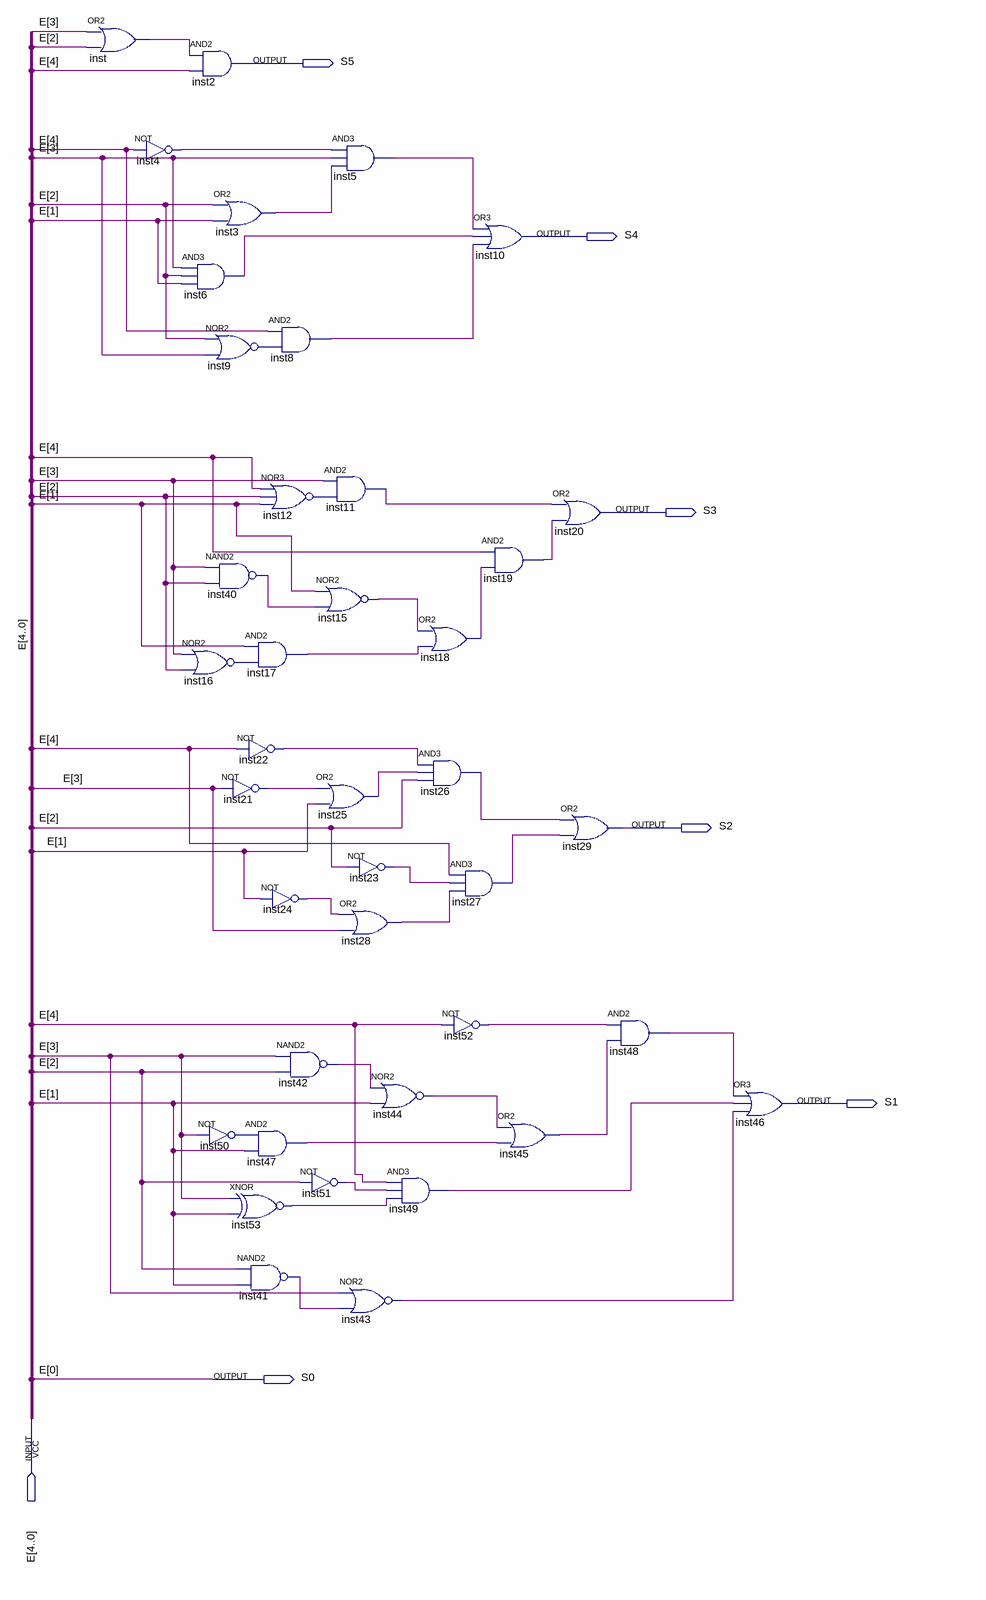
[diagram p0: schematic sheet]
// Quartus schematic SixBitsToBcdPositive.bdf as structural Verilog: 40 symbols, 7 pins
module SixBitsToBcdPositive (
  input  [4:0] E,
  output S5,
  output S4,
  output S3,
  output S2,
  output S1,
  output S0
);

  wire inst3_out, inst4_out, inst5_out, inst6_out, inst8_out, inst9_out, inst11_out, inst12_out, inst15_out,
       inst16_out, inst17_out, inst18_out, inst19_out, inst21_out, inst22_out, inst23_out, inst24_out,
       inst25_out, inst26_out, inst27_out, inst28_out, inst40_out, inst41_out, inst42_out, inst43_out,
       inst44_out, inst45_out, inst47_out, inst48_out, inst49_out, inst50_out, inst51_out, inst52_out,
       inst53_out, inst_out;

  or inst (inst_out, E[3], E[2]);
  not inst4 (inst4_out, E[4]);
  and inst2 (S5, inst_out, E[4]);
  or inst3 (inst3_out, E[2], E[1]);
  and inst6 (inst6_out, E[3], E[2], E[1]);
  nor inst9 (inst9_out, E[2], E[3]);
  nand inst40 (inst40_out, E[3], E[2]);
  nor inst16 (inst16_out, E[3], E[2]);
  not inst21 (inst21_out, E[3]);
  not inst50 (inst50_out, E[3]);
  and inst8 (inst8_out, E[4], inst9_out);
  nor inst12 (inst12_out, E[4], E[2], E[1]);
  and inst17 (inst17_out, E[1], inst16_out);
  not inst22 (inst22_out, E[4]);
  not inst24 (inst24_out, E[1]);
  nand inst42 (inst42_out, E[3], E[2]);
  and inst47 (inst47_out, inst50_out, E[1]);
  xnor inst53 (inst53_out, E[3], E[1]);
  nand inst41 (inst41_out, E[2], E[1]);
  and inst5 (inst5_out, inst4_out, E[3], inst3_out);
  and inst11 (inst11_out, E[3], inst12_out);
  nor inst15 (inst15_out, E[1], inst40_out);
  or inst25 (inst25_out, inst21_out, E[1]);
  not inst23 (inst23_out, E[2]);
  or inst28 (inst28_out, inst24_out, E[3]);
  not inst51 (inst51_out, E[2]);
  nor inst43 (inst43_out, E[3], inst41_out);
  nor inst44 (inst44_out, inst42_out, E[1]);
  and inst49 (inst49_out, E[4], inst51_out, inst53_out);
  or inst10 (S4, inst5_out, inst6_out, inst8_out);
  or inst18 (inst18_out, inst15_out, inst17_out);
  and inst26 (inst26_out, inst22_out, inst25_out, E[2]);
  and inst27 (inst27_out, E[4], inst23_out, inst28_out);
  not inst52 (inst52_out, E[4]);
  and inst19 (inst19_out, E[4], inst18_out);
  or inst45 (inst45_out, inst44_out, inst47_out);
  or inst20 (S3, inst11_out, inst19_out);
  or inst29 (S2, inst26_out, inst27_out);
  and inst48 (inst48_out, inst52_out, inst45_out);
  or inst46 (S1, inst48_out, inst49_out, inst43_out);

  assign S0 = E[0];
endmodule
